# Altium schematic sheet measurement-output-hw.SchDoc
size A1; SheetNumber: 5; SheetTotal: 10
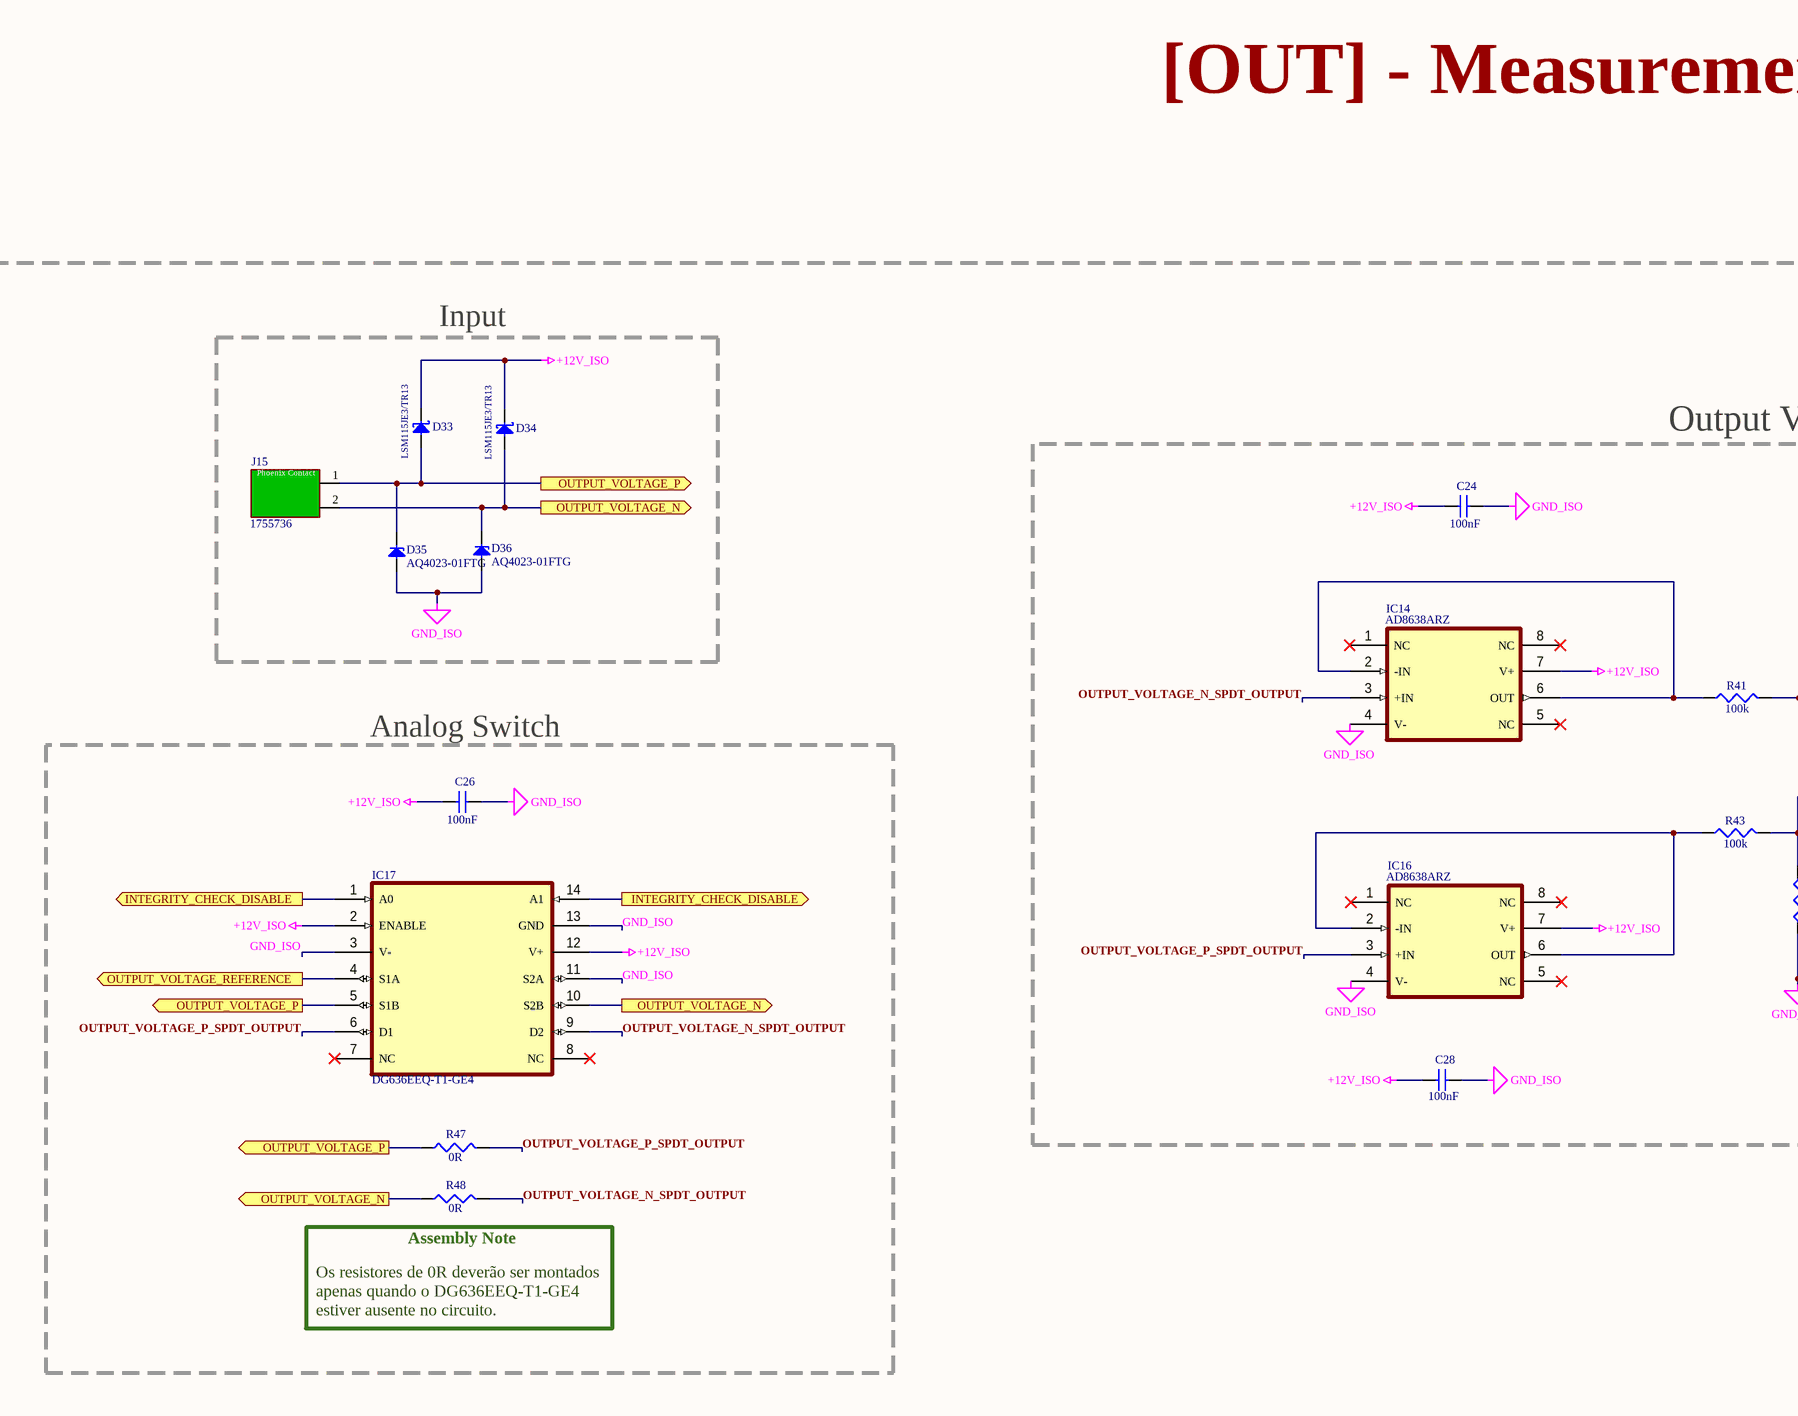
[diagram p0: measurement-output-hw.SchDoc, top left]
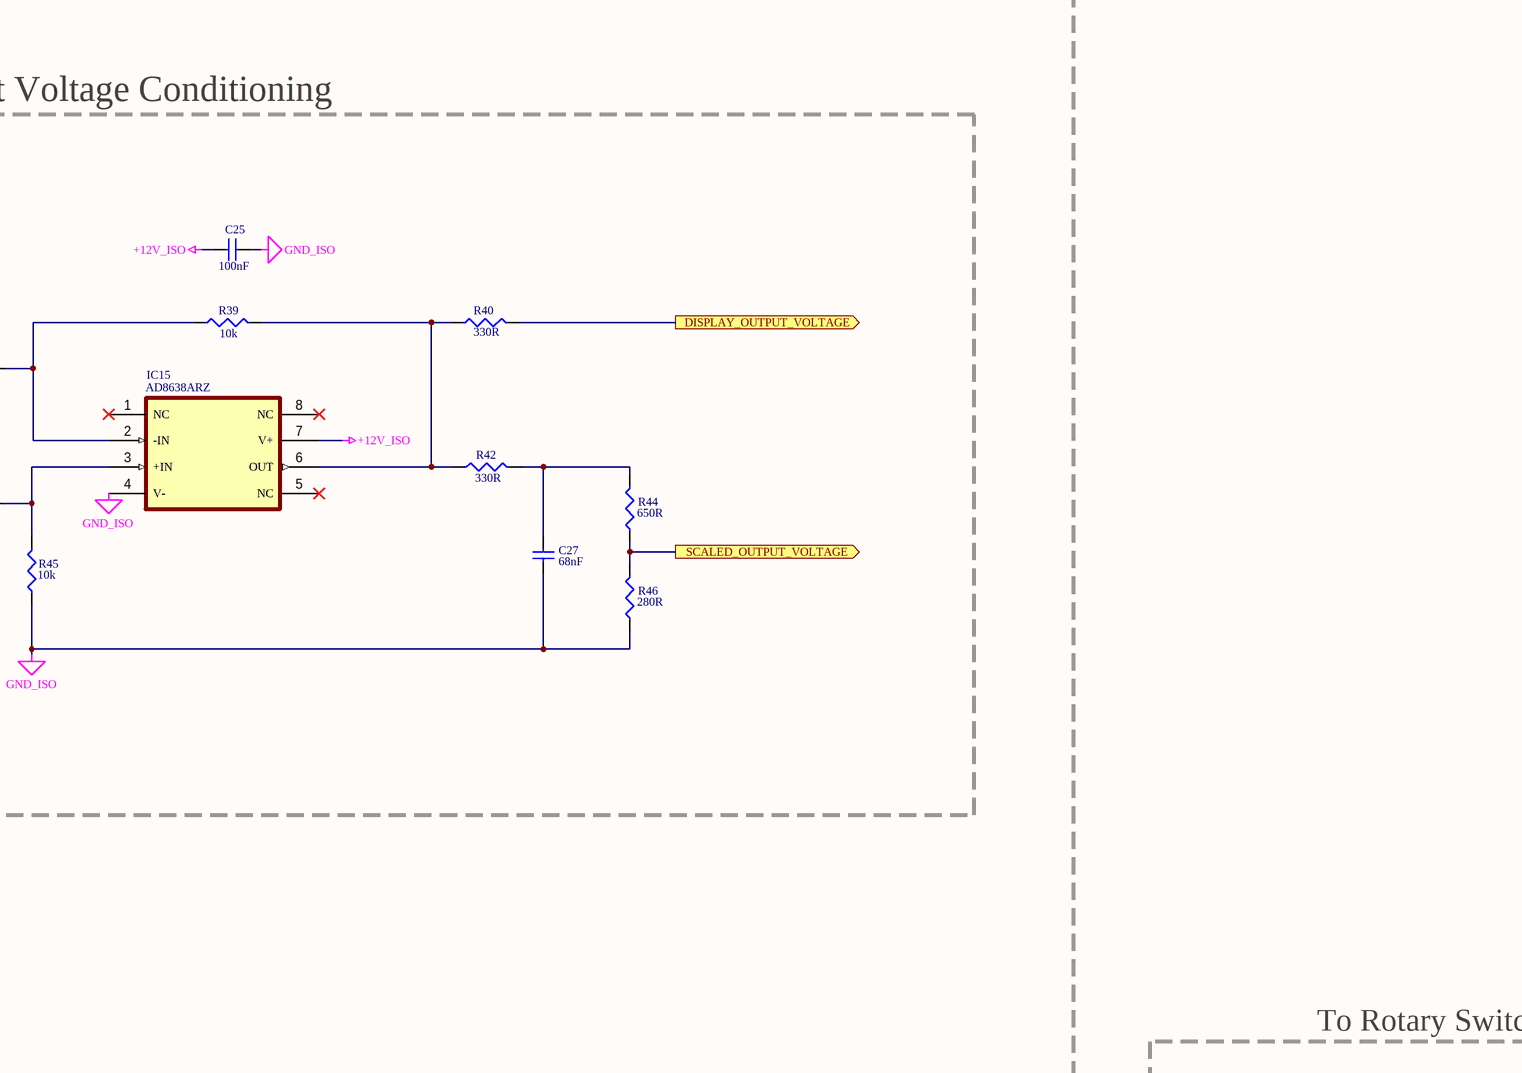
[diagram p1: measurement-output-hw.SchDoc, top right]
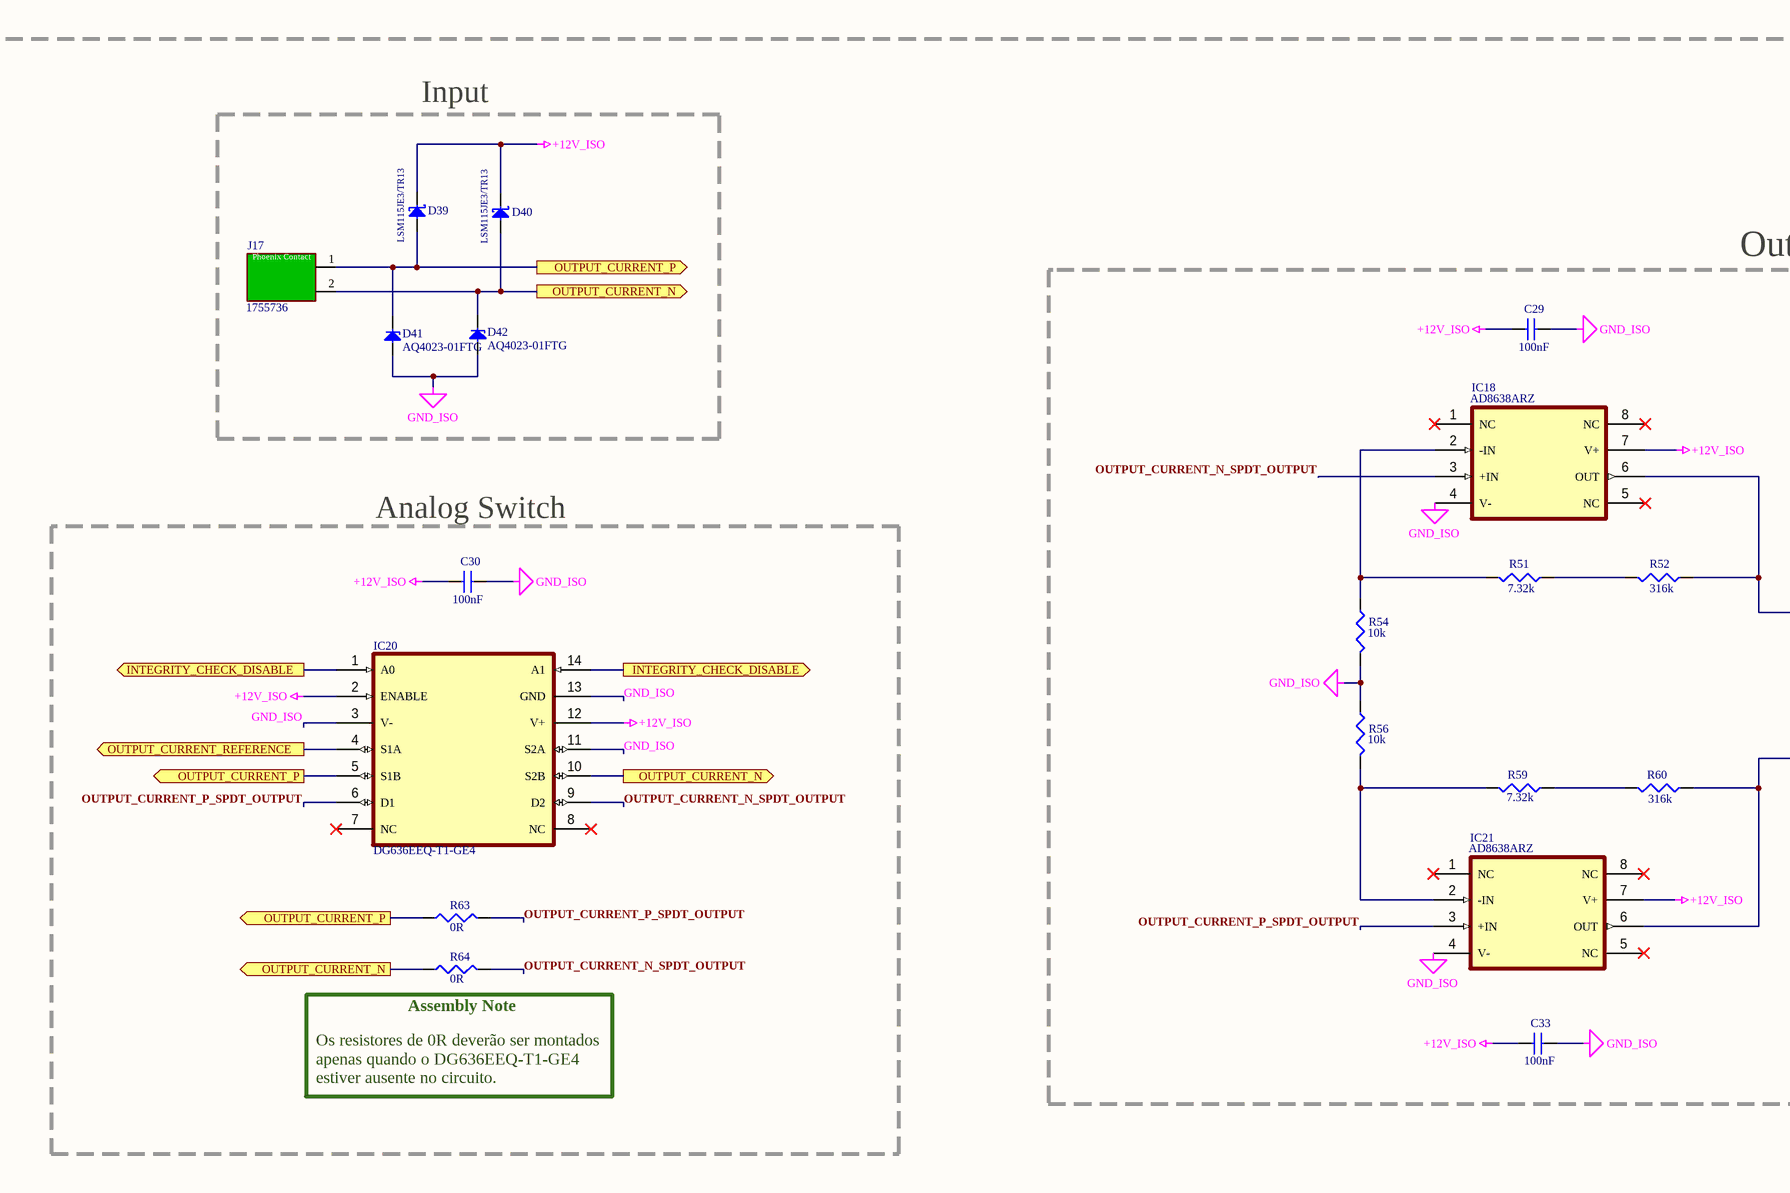
[diagram p2: measurement-output-hw.SchDoc, bottom left]
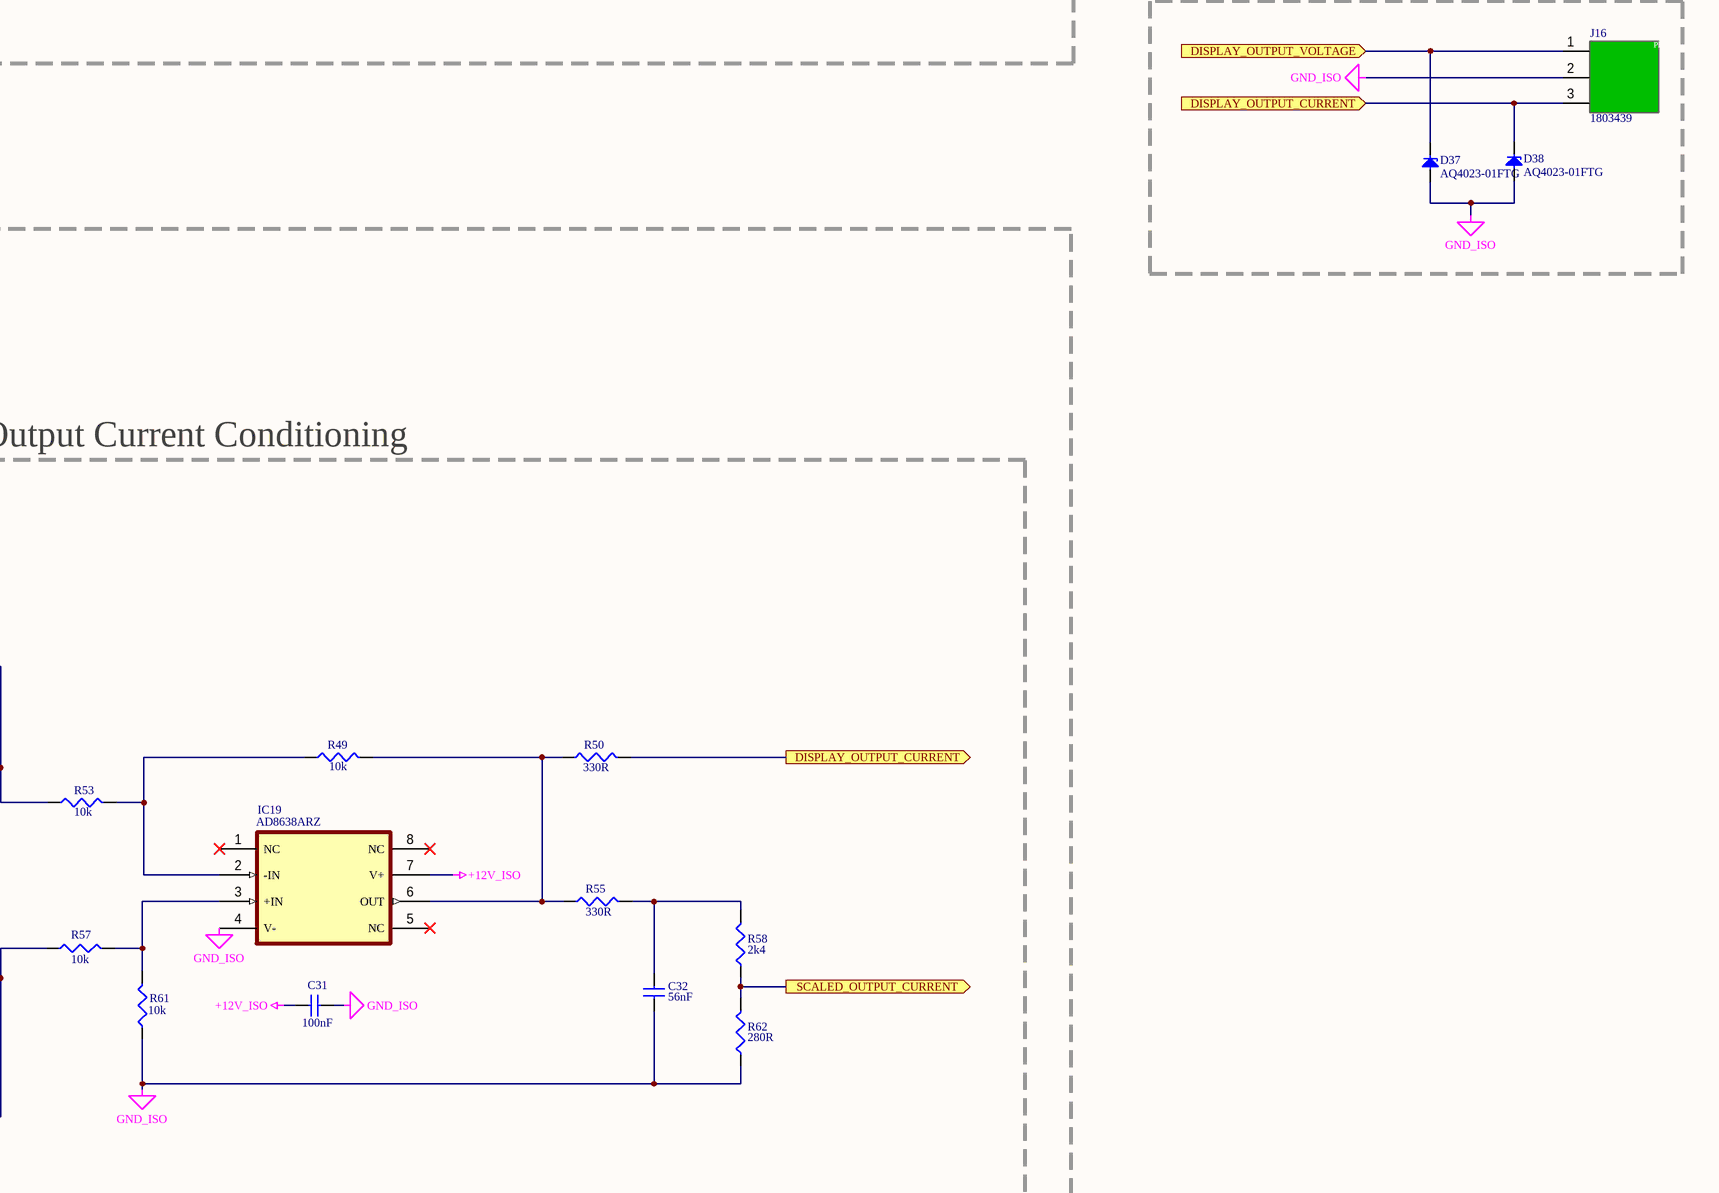
[diagram p3: measurement-output-hw.SchDoc, bottom right]

## Parts
C24  100nF  [C0805]
C25  100nF  [C0805]
C26  100nF  [C0805]
C27  68nF  [C0805]
C28  100nF  [C0805]
C29  100nF  [C0805]
C30  100nF  [C0805]
C31  100nF  [C0805]
C32  56nF  [C0805]
C33  100nF  [C0805]
D33  LSM115JE3/TR13  [DO-214BA]
D34  LSM115JE3/TR13  [DO-214BA]
D35  AQ4023-01FTG  [SOD-323]
D36  AQ4023-01FTG  [SOD-323]
D37  AQ4023-01FTG  [SOD-323]
D38  AQ4023-01FTG  [SOD-323]
D39  LSM115JE3/TR13  [DO-214BA]
D40  LSM115JE3/TR13  [DO-214BA]
D41  AQ4023-01FTG  [SOD-323]
D42  AQ4023-01FTG  [SOD-323]
IC14  AD8638ARZ  [SOIC-8]
IC15  AD8638ARZ  [SOIC-8]
IC16  AD8638ARZ  [SOIC-8]
IC17  DG636EEQ-T1-GE4  [TSSOP-14]
IC18  AD8638ARZ  [SOIC-8]
IC19  AD8638ARZ  [SOIC-8]
IC20  DG636EEQ-T1-GE4  [TSSOP-14]
IC21  AD8638ARZ  [SOIC-8]
J15  1755736  [Conector 2 vias]
J16  1803439  [Conector Phoenix 3 vias]
J17  1755736  [Conector 2 vias]
R39  10k  [Resistor 0805]
R40  330R  [Resistor 0805]
R41  100k  [Resistor 0805]
R42  330R  [Resistor 0805]
R43  100k  [Resistor 0805]
R44  650R  [Resistor 0805]
R45  10k  [Resistor 0805]
R46  280R  [Resistor 0805]
R47  0R  [Resistor 0805]
R48  0R  [Resistor 0805]
R49  10k  [Resistor 0805]
R50  330R  [Resistor 0805]
R51  7.32k  [Resistor 0805]
R52  316k  [Resistor 0805]
R53  10k  [Resistor 0805]
R54  10k  [Resistor 0805]
R55  330R  [Resistor 0805]
R56  10k  [Resistor 0805]
R57  10k  [Resistor 0805]
R58  2k4  [Resistor 0805]
R59  7.32k  [Resistor 0805]
R60  316k  [Resistor 0805]
R61  10k  [Resistor 0805]
R62  280R  [Resistor 0805]
R63  0R  [Resistor 0805]
R64  0R  [Resistor 0805]

## Blocks framed on the sheet
Input: D33-D36 J15
Output Voltage Conditioning: C24 C25 C27 C28 IC14-IC16 R39-R46
Analog Switch: C26 IC17 R47 R48
To Rotary Switch: D37 D38 J16
Input: D39-D42 J17
Output Current Conditioning: C29 C31-C33 IC18 IC19 IC21 R49-R62
Analog Switch: C30 IC20 R63 R64

## Ports
DISPLAY_OUTPUT_CURRENT (in, see measurement-output-hw[9C]), DISPLAY_OUTPUT_CURRENT (out, see measurement-output-hw[10C]), DISPLAY_OUTPUT_VOLTAGE (in, see measurement-output-hw[9A]), DISPLAY_OUTPUT_VOLTAGE (out, see measurement-output-hw[10B]), INTEGRITY_CHECK_DISABLE (out, see calibration-hw[5B], measurement-output-hw[2B], measurement-output-hw[2D], measurement-output-hw[4B], measurement-ps1-hw[1C], measurement-ps1-hw[3C], measurement-ps2-hw[1B], measurement-ps2-hw[3B], measurement-ps3-hw[1B], measurement-ps3-hw[3B]), INTEGRITY_CHECK_DISABLE (out, see calibration-hw[5B], measurement-output-hw[2B], measurement-output-hw[2D], measurement-output-hw[4D], measurement-ps1-hw[1C], measurement-ps1-hw[3C], measurement-ps2-hw[1B], measurement-ps2-hw[3B], measurement-ps3-hw[1B], measurement-ps3-hw[3B]), INTEGRITY_CHECK_DISABLE (out, see calibration-hw[5B], measurement-output-hw[2B], measurement-output-hw[4B], measurement-output-hw[4D], measurement-ps1-hw[1C], measurement-ps1-hw[3C], measurement-ps2-hw[1B], measurement-ps2-hw[3B], measurement-ps3-hw[1B], measurement-ps3-hw[3B]), INTEGRITY_CHECK_DISABLE (out, see calibration-hw[5B], measurement-output-hw[2D], measurement-output-hw[4B], measurement-output-hw[4D], measurement-ps1-hw[1C], measurement-ps1-hw[3C], measurement-ps2-hw[1B], measurement-ps2-hw[3B], measurement-ps3-hw[1B], measurement-ps3-hw[3B]), OUTPUT_CURRENT_N (out, see measurement-output-hw[3C], measurement-output-hw[3D]), OUTPUT_CURRENT_N (out, see measurement-output-hw[3C], measurement-output-hw[4D]), OUTPUT_CURRENT_N (out, see measurement-output-hw[3D], measurement-output-hw[4D]), OUTPUT_CURRENT_P (out, see measurement-output-hw[2D], measurement-output-hw[3C]), OUTPUT_CURRENT_P (out, see measurement-output-hw[2D], measurement-output-hw[3D]), OUTPUT_CURRENT_P (out, see measurement-output-hw[3C], measurement-output-hw[3D]), OUTPUT_CURRENT_REFERENCE (out, see calibration-hw[2B]), OUTPUT_VOLTAGE_N (out, see measurement-output-hw[3A], measurement-output-hw[3B]), OUTPUT_VOLTAGE_N (out, see measurement-output-hw[3A], measurement-output-hw[4B]), OUTPUT_VOLTAGE_N (out, see measurement-output-hw[3B], measurement-output-hw[4B]), OUTPUT_VOLTAGE_P (out, see measurement-output-hw[2B], measurement-output-hw[3A]), OUTPUT_VOLTAGE_P (out, see measurement-output-hw[2B], measurement-output-hw[3B]), OUTPUT_VOLTAGE_P (out, see measurement-output-hw[3A], measurement-output-hw[3B]), OUTPUT_VOLTAGE_REFERENCE (out, see calibration-hw[2B]), SCALED_OUTPUT_CURRENT (out, see isolated-analog-interface-hw[3A]), SCALED_OUTPUT_VOLTAGE (out, see isolated-analog-interface-hw[3A])

## Nets
+12V_ISO: C24.1 C25.1 C26.1 C28.1 C29.1 C30.1 C31.1 C33.1 D33.1(C) D34.1(C) D39.1(C) D40.1(C) IC14.7(V+) IC15.7(V+) IC16.7(V+) IC17.2(ENABLE) IC17.12(V+) IC18.7(V+) IC19.7(V+) IC20.2(ENABLE) IC20.12(V+) IC21.7(V+)
GND_ISO: C24.2 C25.2 C26.2 C27.1 C28.2 C29.2 C30.2 C31.2 C32.1 C33.2 D35.2 D36.2 D37.2 D38.2 D41.2 D42.2 IC14.4(V-) IC15.4(V-) IC16.4(V-) IC17.3(V-) IC17.11(S2A) IC17.13(GND) IC18.4(V-) IC19.4(V-) IC20.3(V-) IC20.11(S2A) IC20.13(GND) IC21.4(V-) J16.2 R45.1 R46.1 R54.2 R56.1 R61.1 R62.1
DISPLAY_OUTPUT_CURRENT: D38.1 J16.3 R50.2 ; port DISPLAY_OUTPUT_CURRENT
DISPLAY_OUTPUT_VOLTAGE: D37.1 J16.1 R40.2 ; port DISPLAY_OUTPUT_VOLTAGE
INTEGRITY_CHECK_DISABLE: IC17.1(A0) IC17.14(A1) IC20.1(A0) IC20.14(A1) ; port INTEGRITY_CHECK_DISABLE
OUTPUT_CURRENT_N: D40.2(A) D42.1 IC20.10(S2B) J17.2 R64.1 ; port OUTPUT_CURRENT_N
OUTPUT_CURRENT_N_SPDT_OUTPUT: IC18.3(+IN) IC20.9(D2) R64.2
OUTPUT_CURRENT_P: D39.2(A) D41.1 IC20.5(S1B) J17.1 R63.1 ; port OUTPUT_CURRENT_P
OUTPUT_CURRENT_P_SPDT_OUTPUT: IC20.6(D1) IC21.3(+IN) R63.2
OUTPUT_CURRENT_REFERENCE: IC20.4(S1A) ; port OUTPUT_CURRENT_REFERENCE
OUTPUT_VOLTAGE_N: D34.2(A) D36.1 IC17.10(S2B) J15.2 R48.1 ; port OUTPUT_VOLTAGE_N
OUTPUT_VOLTAGE_N_SPDT_OUTPUT: IC14.3(+IN) IC17.9(D2) R48.2
OUTPUT_VOLTAGE_P: D33.2(A) D35.1 IC17.5(S1B) J15.1 R47.1 ; port OUTPUT_VOLTAGE_P
OUTPUT_VOLTAGE_P_SPDT_OUTPUT: IC16.3(+IN) IC17.6(D1) R47.2
OUTPUT_VOLTAGE_REFERENCE: IC17.4(S1A) ; port OUTPUT_VOLTAGE_REFERENCE
SCALED_OUTPUT_CURRENT: R58.1 R62.2 ; port SCALED_OUTPUT_CURRENT
SCALED_OUTPUT_VOLTAGE: R44.1 R46.2 ; port SCALED_OUTPUT_VOLTAGE
NetC27_2: C27.2 R42.2 R44.2
NetC32_2: C32.2 R55.2 R58.2
NetIC14_2: IC14.2(-IN) IC14.6(OUT) R41.1
NetIC15_2: IC15.2(-IN) R39.1 R41.2
NetIC15_3: IC15.3(+IN) R43.2 R45.2
NetIC15_6: IC15.6(OUT) R39.2 R40.1 R42.1
NetIC16_2: IC16.2(-IN) IC16.6(OUT) R43.1
NetIC18_2: IC18.2(-IN) R51.1 R54.1
NetIC18_6: IC18.6(OUT) R52.2 R53.1
NetIC19_2: IC19.2(-IN) R49.1 R53.2
NetIC19_3: IC19.3(+IN) R57.2 R61.2
NetIC19_6: IC19.6(OUT) R49.2 R50.1 R55.1
NetIC21_2: IC21.2(-IN) R56.2 R59.1
NetIC21_6: IC21.6(OUT) R57.1 R60.2
NetR51_2: R51.2 R52.1
NetR59_2: R59.2 R60.1

Not connected (* = marked no-connect by the designer): IC14 1(NC)* 5(NC)* 8(NC)*; IC15 1(NC)* 5(NC)* 8(NC)*; IC16 1(NC)* 5(NC)* 8(NC)*; IC17 7(NC)* 8(NC)*; IC18 1(NC)* 5(NC)* 8(NC)*; IC19 1(NC)* 5(NC)* 8(NC)*; IC20 7(NC)* 8(NC)*; IC21 1(NC)* 5(NC)* 8(NC)*

## Notes on the sheet
- [OUT] - Measurement
- (near R48) Assembly Note
- Os resistores de 0R deverão ser montados apenas quando o DG636EEQ-T1-GE4 estiver ausente no circuito.
- (near R64) Assembly Note
- Title:
- Drawn by:
- Revision:
- Copyright CNPEM 2023.
  This documentation describes Open Hardware and is licensed under the CERN OHL S v2. You may redistribute and modify this documentation under the terms of the CERN OHL S v2. (https://www.ohwr.org/cernohl). This documentation is distributed WITHOUT ANY EXPRESS OR IMPLIED WARRANTY, INCLUDING OF MERCHANTABILITY, SATISFACTORY QUALITY AND FITNESS FOR A PARTICULAR PURPOSE. Please see the CERN OHL S v2 for applicable conditions.
- File:
- Date:
- Project:
- Time:
- Sheet
- of
- ENT - AIS - SEI
  Sistemas Eletrônicos e
  Instrumentação
- (in symbol Conector Phoenix 3 vias) Phoenix Contact
- (in symbol Phoenix 1755736) Phoenix Contact

## Library data of the parts
C24-C26 C28-C31 C33 = Capacitor 100nF
C27 = Capacitor 68nF
C32 = Capacitor 56nF
D33 D34 D39 D40 = LSM115JE3/TR13: DIODE SCHOTTKY 15V, 1A, DO214BA
D35-D38 D41 D42 = AQ4023-01FTG: Unidirectional TVS DIode, 12A, 1.3pF
IC14-IC16 IC18 IC19 IC21 = AD8638ARZ: 16V, Auto-Zero, Rail-to-Rail Output Operational Amplifiers
IC17 IC20 = DG636EEQ-T1-GE4: Analog Switch Dual-SPDT, 14 pins; Supplier 1: Newark; Supplier Part Number 1: 56AJ9808
J15 J17 = Phoenix 1755736: Term Block HDR 2POS VERT 5.08MM
J16 = Conector Phoenix 3 vias
R39 R45 R49 R53 R54 R56 R57 R61 = Resistor 10k
R40 R42 R50 R55 = Resistor 330R
R41 R43 = Resistor 100k
R44 = Resistor 650R
R46 R62 = Resistor 280R
R47 R48 R63 R64 = Resistor 0R - 0805: Size 0805
R51 R59 = Resistor 7.32k
R52 R60 = Resistor 316k
R58 = Resistor 2k4